# Altium schematic sheet CAN.SchDoc
size A3
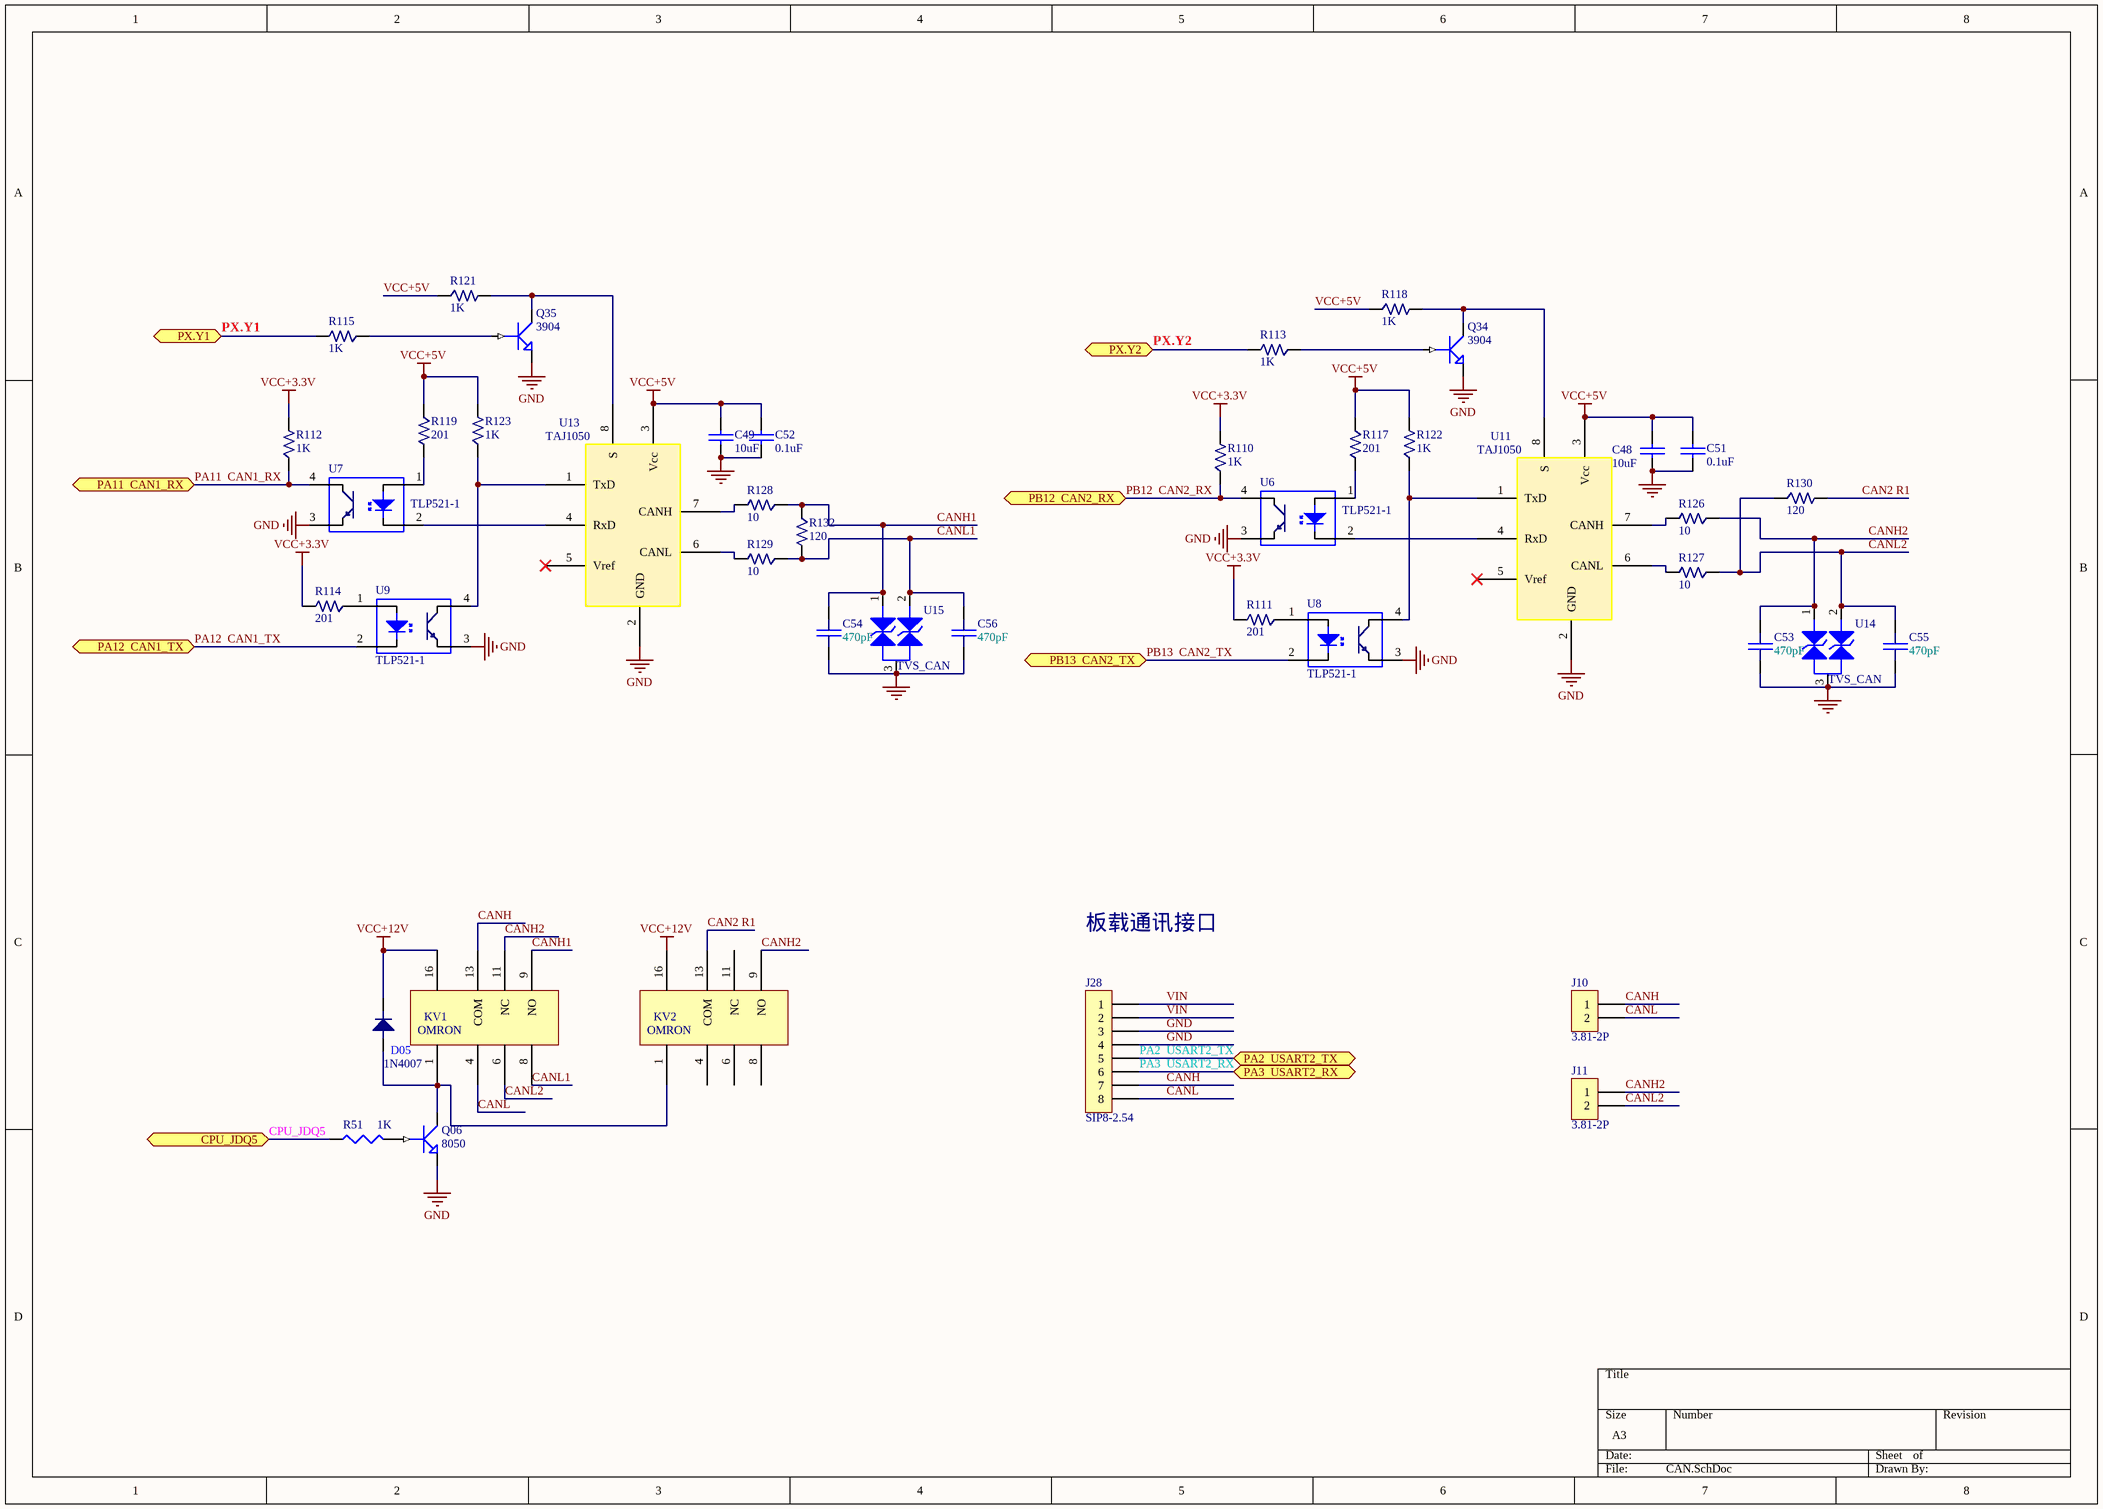
[diagram p0: CAN.SchDoc]

## Parts
C48  10uF  [0805]
C49  10uF  [0805]
C51  0.1uF  [0603]
C52  0.1uF  [0603]
C53  470pF  [0603]
C54  470pF  [0603]
C55  470pF  [0603]
C56  470pF  [0603]
D05  1N4007  [DO-214AC(SMA)]
J10  3.81-2P  [3.81-2P]
J11  3.81-2P  [3.81-2P]
J28  SIP8-2.54  [2.54-8]
KV1  OMRON  [KV]
KV2  OMRON  [KV]
Q06  8050  [SOT-23]
Q34  3904  [SOT-23]
Q35  3904  [SOT-23]
R51  1K  [0603]
R110  1K  [0603]
R111  201  [0603]
R112  1K  [0603]
R113  1K  [0603]
R114  201  [0603]
R115  1K  [0603]
R117  201  [0603]
R118  1K  [0603]
R119  201  [0603]
R121  1K  [0603]
R122  1K  [0603]
R123  1K  [0603]
R126  10  [0603]
R127  10  [0603]
R128  10  [0603]
R129  10  [0603]
R130  120  [0603]
R132  120  [0603]
U6  TLP521-1  [DIP4]
U7  TLP521-1  [DIP4]
U8  TLP521-1  [DIP4]
U9  TLP521-1  [DIP4]
U11  TAJ1050  [SO-8]
U13  TAJ1050  [SO-8]
U14  TVS_CAN  [SOT-23]
U15  TVS_CAN  [SOT-23]

## Ports
CPU_JDQ5, PA2  USART2_TX, PA3  USART2_RX, PA11  CAN1_RX, PA12  CAN1_TX, PB12  CAN2_RX, PB13  CAN2_TX, PX.Y1, PX.Y2

## Nets
GND: C48.1 C49.1 C51.1 C52.1 C53.2 C54.2 C55.2 C56.2 J28.3 J28.4 Q06.2(E) Q34.2(E) Q35.2(E) U6.3 U7.3 U8.3 U9.3 U11.2(GND) U13.2(GND) U14.3 U15.3
VCC+3.3V: R110.2 R111.2 R112.2 R114.2
VCC+5V: C48.2 C49.2 C51.2 C52.2 R117.1 R118.1 R119.1 R121.1 R122.2 R123.2 U11.3(Vcc) U13.3(Vcc)
VCC+12V: D05.2 KV1.16 KV2.16
CAN2 R1: KV2.13(COM) R130.2
CANH: J10.1 J28.7 KV1.13(COM)
CANH1: C54.1 KV1.9(NO) R128.1 R132.1 U15.1
CANH2: C53.1 J11.1 KV1.11(NC) KV2.9(NO) R126.1 U14.1
CANL: J10.2 J28.8 KV1.4
CANL1: C56.1 KV1.8 R129.1 R132.2 U15.2(K)
CANL2: C55.1 J11.2 KV1.6 R127.1 R130.1 U14.2(K)
CPU_JDQ5: R51.1 ; port CPU_JDQ5
PA2  USART2_TX: J28.5 ; port PA2  USART2_TX
PA3  USART2_RX: J28.6 ; port PA3  USART2_RX
PA11  CAN1_RX: R112.1 U7.4 ; port PA11  CAN1_RX
PA12  CAN1_TX: U9.2 ; port PA12  CAN1_TX
PB12  CAN2_RX: R110.1 U6.4 ; port PB12  CAN2_RX
PB13  CAN2_TX: U8.2 ; port PB13  CAN2_TX
PX.Y1: R115.2 ; port PX.Y1
PX.Y2: R113.2 ; port PX.Y2
VIN: J28.1 J28.2
NetD05_1: D05.1 KV1.1 KV2.1 Q06.3(C)
NetQ06_1: Q06.1(B) R51.2
NetQ34_1: Q34.1(B) R113.1
NetQ34_3: Q34.3(C) R118.2 U11.8(S)
NetQ35_1: Q35.1(B) R115.1
NetQ35_3: Q35.3(C) R121.2 U13.8(S)
NetR111_1: R111.1 U8.1
NetR114_1: R114.1 U9.1
NetR117_2: R117.2 U6.1
NetR119_2: R119.2 U7.1
NetR122_1: R122.1 U8.4 U11.1(TxD)
NetR123_1: R123.1 U9.4 U13.1(TxD)
NetR126_2: R126.2 U11.7(CANH)
NetR127_2: R127.2 U11.6(CANL)
NetR128_2: R128.2 U13.7(CANH)
NetR129_2: R129.2 U13.6(CANL)
NetU6_2: U6.2 U11.4(RxD)
NetU7_2: U7.2 U13.4(RxD)

Not connected (* = marked no-connect by the designer): KV2 4(1) 6(2) 8(3) 11(NC); U11 5(Vref)*; U13 5(Vref)*

## Notes on the sheet
- 板载通讯接口

## Library data of the parts
C48 C49 C51 C52 = CAP
C53-C56 = CAP: 陶瓷电容
D05 = 1N4007: 1A整流二极管
J10 J11 = SIP2A-2.50（带槽）
KV1 KV2 = OMRON: omron G5V-2 12VDC
Q06 Q34 Q35 = NPN1
R51 = RES1
R110-R115 R117-R119 R121-R123 R126-R130 R132 = RES-1%: 高精度电阻
U6-U9 = TLP521: 光耦
U14 U15 = TVS_CAN: NUP2105L